# EAGLE schematic shield_v8 (EAGLE 6.5.0)
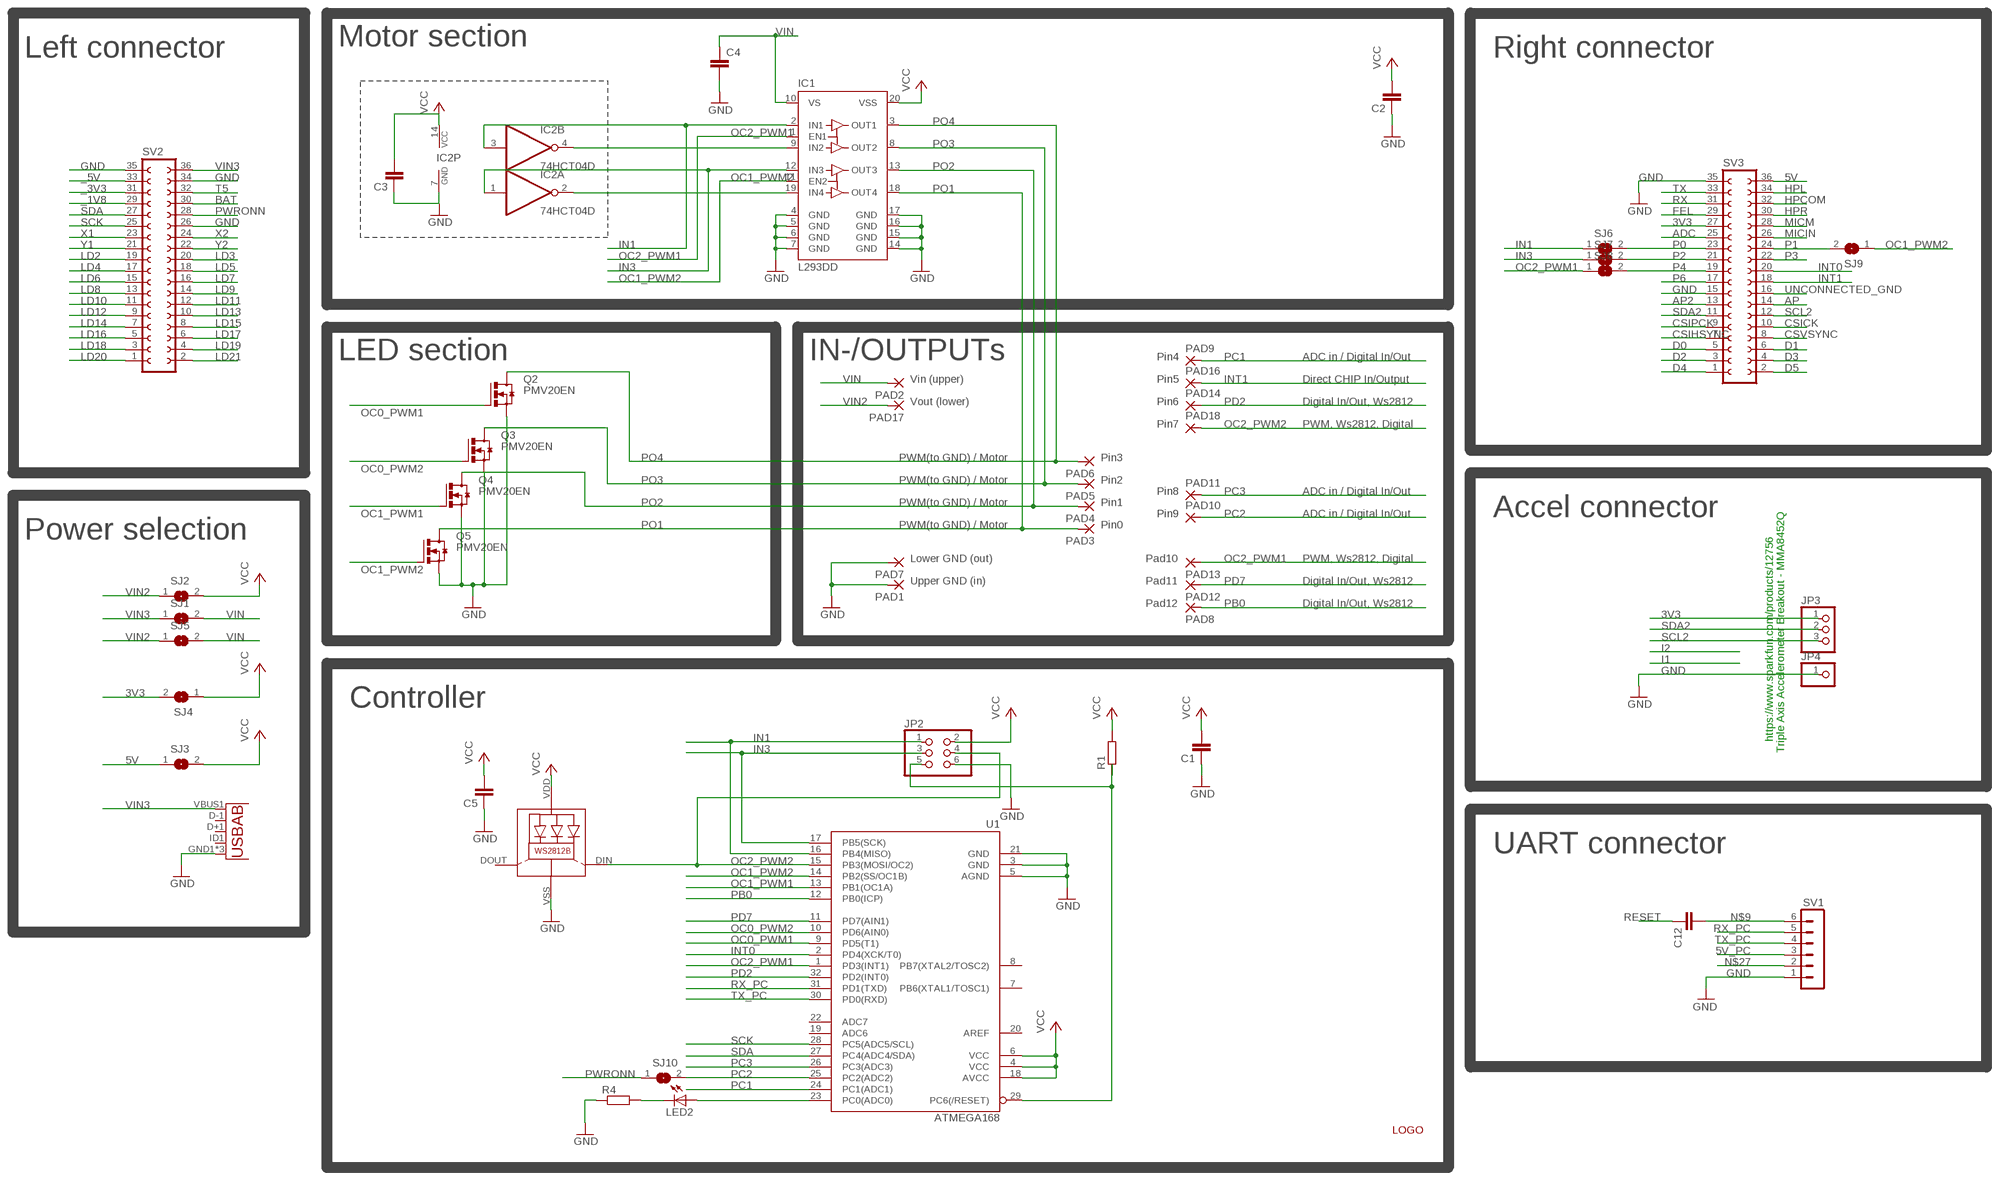
[diagram p0: schematic, sheet 1]

## Parts
C1  C-EUC0805  [C0805]
C2  C-EUC0805  [C0805]
C3  C-EUC0805  [C0805]
C4  C-EUC1210  [C1210]
C5  C-EUC0805  [C0805]
C12  C-EUC1206  [C1206]
IC1  L293DD  [SO20]
IC2  74HCT04D  [SO14]
JP2  PINHD-2X3  [2X03]
JP3  PINHD-1X3  [1X03]
JP4  PINHD-1X1  [1X01]
LED1  WS2812B  [WS2812B]
LED2  LEDCHIP-LED0805  [CHIP-LED0805]
PAD1  3,17/1,3  [3,17/1,3]
PAD2  3,17/1,3  [3,17/1,3]
PAD3  3,17/1,3  [3,17/1,3]
PAD4  3,17/1,3  [3,17/1,3]
PAD5  3,17/1,3  [3,17/1,3]
PAD6  3,17/1,3  [3,17/1,3]
PAD7  3,17/1,3  [3,17/1,3]
PAD8  WIREPADSMD1,27-254  [SMD1,27-2,54]
PAD9  3,17/1,3  [3,17/1,3]
PAD10  3,17/1,3  [3,17/1,3]
PAD11  3,17/1,3  [3,17/1,3]
PAD12  SMD2  [SMD1,27-2,54]
PAD13  SMD2  [SMD1,27-2,54]
PAD14  3,17/1,3  [3,17/1,3]
PAD16  3,17/1,3  [3,17/1,3]
PAD17  3,17/1,3  [3,17/1,3]
PAD18  3,17/1,3  [3,17/1,3]
Q2  PMV20EN  NMOSFET_SMD_223  [SOT223]
Q3  PMV20EN  NMOSFET_SMD_223  [SOT223]
Q4  PMV20EN  NMOSFET_SMD_223  [SOT223]
Q5  PMV20EN  NMOSFET_SMD_223  [SOT223]
R1  R-EU_M1206  [M1206]
R4  R-EU_M1206  [M1206]
SJ1  SJ  [SJ]
SJ2  SJ  [SJ]
SJ3  SJ  [SJ]
SJ4  SJ  [SJ]
SJ5  SJ  [SJ]
SJ6  SJ  [SJ]
SJ7  SJ  [SJ]
SJ8  SJ  [SJ]
SJ9  SJ  [SJ]
SJ10  SJ  [SJ]
SV1  MA06-1  [MA06-1]
SV2  FE18-2  [FE18-2]
SV3  FE18-2  [FE18-2]
U1  ATMEGA168  [TQFP32-08]
U2  USB""  [USB-MICRO-SMD]
U$2  LOGO  [LOGO]

## Nets
3V3: JP3.1 SJ4.2 SV3.27
5V: SJ3.1 SV3.36
5V_PC: SV1.3
_1V8: SV2.29
_3V3: SV2.31
_5V: SV2.33
ADC: SV3.25
AP: SV3.14
AP2: SV3.13
BAT: SV2.30
CSICK: SV3.10
CSIHSYNC: SV3.7
CSIPCK: SV3.9
CSVSYNC: SV3.8
D0: SV3.5
D1: SV3.6
D2: SV3.3
D3: SV3.4
D4: SV3.1
D5: SV3.2
FEL: SV3.29
GND: C1.1 C2.1 C3.1 C4.2 C5.1 IC1.4(GND) IC1.5(GND) IC1.6(GND) IC1.7(GND) IC1.14(GND) IC1.15(GND) IC1.16(GND) IC1.17(GND) IC2.7(P:GND) JP2.6 JP4.1 LED1.VSS(GND) PAD1.1(P) PAD7.1(P) Q2.3(S) Q3.3(S) Q4.3(S) Q5.3(S) R4.1 SV1.1 SV2.26 SV2.34 SV2.35 SV3.15 SV3.35 U1.3(GND) U1.5(AGND) U1.21(GND) U2.GND1(GND) U2.GND2(GND) U2.GND3(GND)
HPCOM: SV3.32
HPL: SV3.34
HPR: SV3.30
IN1: IC1.2(IN1) IC2.3(B:I) JP2.1 SJ6.1 U1.16(PB4(MISO))
IN3: IC1.12(IN3) IC2.1(A:I) JP2.3 SJ7.1 U1.17(PB5(SCK))
INT0: SV3.20 U1.2(PD4(XCK/T0))
INT1: PAD16.1(P) SV3.18
LD2: SV2.19
LD3: SV2.20
LD4: SV2.17
LD5: SV2.18
LD6: SV2.15
LD7: SV2.16
LD8: SV2.13
LD9: SV2.14
LD10: SV2.11
LD11: SV2.12
LD12: SV2.9
LD13: SV2.10
LD14: SV2.7
LD15: SV2.8
LD16: SV2.5
LD17: SV2.6
LD18: SV2.3
LD19: SV2.4
LD20: SV2.1
LD21: SV2.2
MICIN: SV3.26
MICM: SV3.28
N$1: IC1.19(IN4) IC2.2(A:O)
N$9: C12.2 SV1.6
N$11: IC1.9(IN2) IC2.4(B:O)
N$23: LED2.C R4.2
N$26: LED2.A U1.23(PC0(ADC0))
N$27: SV1.2
OC0_PWM1: Q2.1(G) U1.9(PD5(T1))
OC0_PWM2: Q3.1(G) U1.10(PD6(AIN0))
OC1_PWM1: Q4.1(G) U1.13(PB1(OC1A))
OC1_PWM2: IC1.11(EN2) Q5.1(G) SJ9.1 U1.14(PB2(SS/OC1B))
OC2_PWM1: IC1.1(EN1) PAD13.1(P) SJ8.1 U1.1(PD3(INT1))
OC2_PWM2: JP2.4 LED1.DIN(DI) PAD18.1(P) U1.15(PB3(MOSI/OC2))
P0: SJ6.2 SV3.23
P1: SJ9.2 SV3.24
P2: SJ7.2 SV3.21
P3: SV3.22
P4: SJ8.2 SV3.19
P6: SV3.17
PB0: PAD8.1(P) U1.12(PB0(ICP))
PC1: PAD9.1(P) U1.24(PC1(ADC1))
PC2: PAD10.1(P) SJ10.2 U1.25(PC2(ADC2))
PC3: PAD11.1(P) U1.26(PC3(ADC3))
PD2: PAD14.1(P) U1.32(PD2(INT0))
PD7: PAD12.1(P) U1.11(PD7(AIN1))
PO1: IC1.18(OUT4) PAD3.1(P) Q5.2(D) Q5.4(D)
PO2: IC1.13(OUT3) PAD4.1(P) Q4.2(D) Q4.4(D)
PO3: IC1.8(OUT2) PAD5.1(P) Q3.2(D) Q3.4(D)
PO4: IC1.3(OUT1) PAD6.1(P) Q2.2(D) Q2.4(D)
PWRONN: SJ10.1 SV2.28
RESET: C12.1 JP2.5 R1.1 U1.29(PC6(/RESET))
RX: SV3.31
RX_PC: SV1.5 U1.31(PD1(TXD))
SCK: SV2.25 U1.28(PC5(ADC5/SCL))
SCL2: JP3.3 SV3.12
SDA: SV2.27 U1.27(PC4(ADC4/SDA))
SDA2: JP3.2 SV3.11
T5: SV2.32
TX: SV3.33
TX_PC: SV1.4 U1.30(PD0(RXD))
UNCONNECTED_GND: SV3.16
VCC: C1.2 C2.2 C3.2 C5.2 IC1.20(VSS) IC2.14(P:VCC) JP2.2 LED1.VDD R1.2 SJ2.2 SJ3.2 SJ4.1 U1.4(VCC) U1.6(VCC) U1.18(AVCC)
VIN: C4.1 IC1.10(VS) PAD2.1(P) SJ1.2 SJ5.2
VIN2: PAD17.1(P) SJ2.1 SJ5.1
VIN3: SJ1.1 SV2.36 U2.VBUS1(VBUS)
X1: SV2.23
X2: SV2.24
Y1: SV2.21
Y2: SV2.22
Unconnected: IC2.5(C:I) IC2.6(C:O) IC2.8(D:O) IC2.9(D:I) IC2.10(E:O) IC2.11(E:I) IC2.12(F:O) IC2.13(F:I) LED1.DOUT(DO) U1.7(PB6(XTAL1/TOSC1)) U1.8(PB7(XTAL2/TOSC2)) U1.19(ADC6) U1.20(AREF) U1.22(ADC7) U2.D+1(D+) U2.D-1(D-) U2.ID1(USBID)

## Notes on the sheet
- Motor section
- Left connector | Right connector
- LED section | IN-/OUTPUTs | Pin4 | ADC in / Digital In/Out
- Vin (upper) | Pin5 | Direct CHIP In/Output
- Vout (lower) | Pin6 | Digital In/Out, Ws2812
- Pin7 | PWM, Ws2812, Digital
- PWM(to GND) / Motor | Pin3
- PWM(to GND) / Motor | Pin2
- Pin8 | ADC in / Digital In/Out
- PWM(to GND) / Motor | Pin1
- Pin9 | ADC in / Digital In/Out | Accel connector
- PWM(to GND) / Motor | Pin0
- Power selection
- Lower GND (out) | Pad10 | PWM, Ws2812, Digital
- Upper GND (in) | Pad11 | Digital In/Out, Ws2812
- Pad12 | Digital In/Out, Ws2812
- Controller
- https://www.sparkfun.com/products/12756
- Triple Axis Accelerometer Breakout - MMA8452Q
- UART connector

## Library data of the parts
C1-C5 C12 = rcl:C-EU: CAPACITOR, European symbol
IC1 = st-microelectronics:L293DD: PUSH-PULL FOUR CHANNEL DRIVER WITH DIODES Source: http://www.st.com/stonline/books/pdf/docs/1330.pdf; OC_FARNELL: unknown
IC2 = 74xx-eu:74*04: Hex INVERTER
JP2 = pinhead:PINHD-2X3: PIN HEADER
JP3 = adafruit:PINHD-1X3: PIN HEADER
JP4 = adafruit:PINHD-1X1: Pin header 1x1 for 0.1" spacing With round pins
LED1 = WS2812B:WS2812B: Features and Benefits  * Intelligent reverse connect protection, the power supply reverse connection does not damage the IC. * The control circuit and the LED share the only power source. Control circuit and RGB chip are integrated in a package of 5050 components, form a complete control of pixel point.  * Built-in signal reshaping circuit, after wave reshaping to the next driver, ensure wave-form distortion not accumulate.  * Built-in electric reset circuit and power lost reset circuit.  * Each pixel of the three primary color can achieve 256 brightness display, completed 16777216 color full color display, and scan frequency not less than 400Hz/s.  * Cascading port transmission signal by single line.  * Any two point the distance more than 5m transmission signal without any increase circuit.  * When the refresh rate is 30fps, cascade number are not less than1024 points.  * Send data at speeds of 800Kbps.  *The color of the light were highly consistent, cost-effective. Applications  Full-color module, Full color soft lights a lamp strip. LED decorative lighting, Indoor/outdoor LED video irregular screen. General description WS2812B is a intelligent control LED light source that the control circuit and RGB chip are integrated in a package of 5050 components. It internal include intelligent digital port data latch and signal reshaping amplification drive circuit. Also include a precision internal oscillator and a 12V voltage programmable constant curre-nt control part, effectively ensuring the pixel point light color height consistent. The data transfer protocol use single NZR communication mode. After the pixel power-on reset, the DIN port receive data from controller, the first pixel collect initial 24bit data then sent to the internal data latch, the other data which reshaping by the internal signal reshaping amplification circuit sent to the next cascade pixel through the DO port. After transmission for each pixel,the signal to reduce 24bit. pixel adopt auto reshaping transmit technology, making the pixel cascade number is not limited the signal transmission, only depend on the speed of signal transmission. LED with low driving voltage, environmental protection and energy saving, high brightness, scattering angle is large, good consistency, low power, long life and other advantages. The control chip integrated in LED above becoming more simple circuit, small volume, convenient installation. Absolute Maximum Ratings Power supply voltage: VDD +3.5V..+5.3V Input voltage: VI -0.5V..VDD+0.5V based on WS2812 from https://github.com/adafruit/Adafruit-Eagle-Library
LED2 = led:LED: LED OSRAM: - CHIPLED LG R971, LG N971, LY N971, LG Q971, LY Q971, LO R971, LY R971 LH N974, LH R974 LS Q976, LO Q976, LY Q976 LO Q996 - Hyper CHIPLED LW Q18S LB Q993, LB Q99A, LB R99A - SideLED LS A670, LO A670, LY A670, LG A670, LP A670 LB A673, LV A673, LT A673, LW A673 LH A674 LY A675 LS A676, LA A676, LO A676, LY A676, LW A676 LS A679, LY A679, LG A679 - Hyper Micro SIDELED® LS Y876, LA Y876, LO Y876, LY Y876 LT Y87S - SmartLED LW L88C, LW L88S LB L89C, LB L89S, LG L890 LS L89K, LO L89K, LY L89K LS L896, LA L896, LO L896, LY L896 - TOPLED LS T670, LO T670, LY T670, LG T670, LP T670 LSG T670, LSP T670, LSY T670, LOP T670, LYG T670 LG T671, LOG T671, LSG T671 LB T673, LV T673, LT T673, LW T673 LH T674 LS T676, LA T676, LO T676, LY T676, LB T676, LH T676, LSB T676, LW T676 LB T67C, LV T67C, LT T67C, LS T67K, LO T67K, LY T67K, LW E67C LS E67B, LA E67B, LO E67B, LY E67B, LB E67C, LV E67C, LT E67C LW T67C LS T679, LY T679, LG T679 LS T770, LO T770, LY T770, LG T770, LP T770 LB T773, LV T773, LT T773, LW T773 LH T774 LS E675, LA E675, LY E675, LS T675 LS T776, LA T776, LO T776, LY T776, LB T776 LHGB T686 LT T68C, LB T68C - Hyper Mini TOPLED® LB M676 - Mini TOPLED Santana® LG M470 LS M47K, LO M47K, LY M47K Source: http://www.osram.convergy.de LUXEON: - LUMILED® LXK2-PW12-R00, LXK2-PW12-S00, LXK2-PW14-U00, LXK2-PW14-V00 LXK2-PM12-R00, LXK2-PM12-S00, LXK2-PM14-U00 LXK2-PE12-Q00, LXK2-PE12-R00, LXK2-PE12-S00, LXK2-PE14-T00, LXK2-PE14-U00 LXK2-PB12-K00, LXK2-PB12-L00, LXK2-PB12-M00, LXK2-PB14-N00, LXK2-PB14-P00, LXK2-PB14-Q00 LXK2-PR12-L00, LXK2-PR12-M00, LXK2-PR14-Q00, LXK2-PR14-R00 LXK2-PD12-Q00, LXK2-PD12-R00, LXK2-PD12-S00 LXK2-PH12-R00, LXK2-PH12-S00 LXK2-PL12-P00, LXK2-PL12-Q00, LXK2-PL12-R00 Source: www.luxeon.com KINGBRIGHT: KA-3528ASYC Source: www.kingbright.com
PAD1-PAD7 PAD9-PAD11 PAD14 PAD16-PAD18 = wirepad:3,17/1,3: THROUGH-HOLE PAD
PAD8 = wirepad:WIREPAD: Wire PAD connect wire on PCB
PAD12 PAD13 = wirepad:SMD2: SMD PAD
Q2-Q5 = transistor-power:NMOSFET_SMD_223
R1 R4 = rcl:R-EU_: RESISTOR, European symbol
SJ1-SJ10 = jumper:SJ: SMD solder JUMPER
SV1 = con-lstb:MA06-1: PIN HEADER; OC_FARNELL: unknown; OC_NEWARK: unknown
SV2 SV3 = con-lsta:FE18-2: FEMALE HEADER; OC_FARNELL: unknown; OC_NEWARK: unknown
U1 = SparkFun-DigitalIC:ATMEGA168: Atmel 32-pin 8-bit micro, 16k flash.
U2 = MicroUSB:USB: This is a USB AB connector that is compatible with USB OTG. i.e. this connector can serve as a host or device
U$2 = logo:LOGO